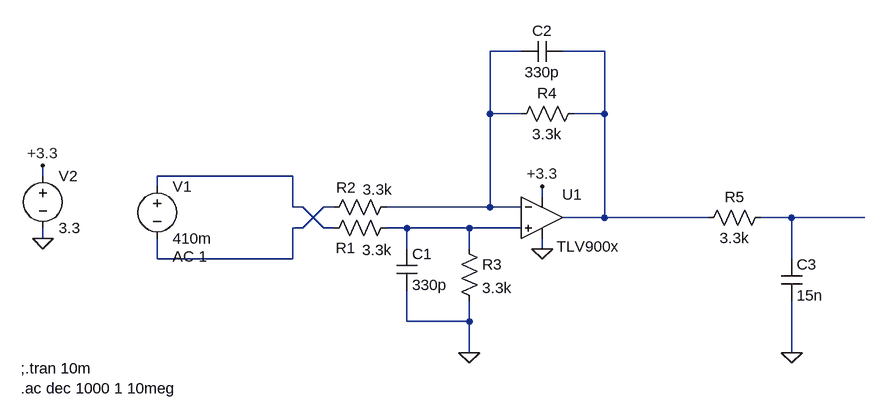
[diagram p0: schematic diff_to_singleended.asc]
diff_to_singleended.asc, the LTspice schematic file:
Version 4
SHEET 1 880 680
WIRE 176 -80 128 -80
WIRE 304 -80 240 -80
WIRE 128 16 128 -80
WIRE 176 16 128 16
WIRE 304 16 304 -80
WIRE 304 16 256 16
WIRE -560 112 -560 96
WIRE -176 112 -384 112
WIRE -384 128 -384 112
WIRE 208 144 208 128
WIRE -176 160 -176 112
WIRE -160 160 -176 160
WIRE -112 160 -128 160
WIRE 128 160 128 16
WIRE 128 160 -32 160
WIRE 176 160 128 160
WIRE 304 176 304 16
WIRE 304 176 240 176
WIRE 464 176 304 176
WIRE 592 176 544 176
WIRE 704 176 592 176
WIRE -160 192 -128 160
WIRE -160 192 -176 192
WIRE -128 192 -160 160
WIRE -112 192 -128 192
WIRE 0 192 -32 192
WIRE 96 192 0 192
WIRE 176 192 96 192
WIRE -560 208 -560 192
WIRE 0 224 0 192
WIRE 96 224 96 192
WIRE 208 224 208 208
WIRE -384 240 -384 208
WIRE -176 240 -176 192
WIRE -176 240 -384 240
WIRE 592 240 592 176
WIRE 0 336 0 288
WIRE 96 336 96 304
WIRE 96 336 0 336
WIRE 96 384 96 336
WIRE 592 384 592 304
FLAG 96 384 0
FLAG 208 224 0
FLAG 208 128 +3.3
FLAG -560 208 0
FLAG -560 96 +3.3
FLAG 592 384 0
SYMBOL AutoGenerated\\TLV900x 208 176 R0
WINDOW 0 46 -20 Bottom 2
WINDOW 3 71 29 Top 2
SYMATTR InstName U1
SYMBOL res -16 176 R90
WINDOW 0 62 78 VBottom 2
WINDOW 3 34 30 VTop 2
SYMATTR InstName R1
SYMATTR Value 3.3k
SYMBOL res -16 144 R90
WINDOW 0 1 77 VBottom 2
WINDOW 3 -27 29 VTop 2
SYMATTR InstName R2
SYMATTR Value 3.3k
SYMBOL cap -16 224 R0
SYMATTR InstName C1
SYMATTR Value 330p
SYMBOL res 80 208 R0
SYMATTR InstName R3
SYMATTR Value 3.3k
SYMBOL res 272 0 R90
WINDOW 0 0 56 VBottom 2
WINDOW 3 32 56 VTop 2
SYMATTR InstName R4
SYMATTR Value 3.3k
SYMBOL cap 240 -96 R90
WINDOW 0 0 32 VBottom 2
WINDOW 3 32 32 VTop 2
SYMATTR InstName C2
SYMATTR Value 330p
SYMBOL voltage -384 112 R0
WINDOW 123 24 124 Left 2
WINDOW 39 0 0 Left 0
SYMATTR InstName V1
SYMATTR Value 410m
SYMATTR Value2 AC 1
SYMBOL voltage -560 96 R0
WINDOW 123 0 0 Left 0
WINDOW 39 0 0 Left 0
SYMATTR InstName V2
SYMATTR Value 3.3
SYMBOL res 560 160 R90
WINDOW 0 0 56 VBottom 2
WINDOW 3 32 56 VTop 2
SYMATTR InstName R5
SYMATTR Value 3.3k
SYMBOL cap 576 240 R0
SYMATTR InstName C3
SYMATTR Value 15n
TEXT -594 408 Left 2 !;.tran 10m\n.ac dec 1000 1 10meg

The netlist it stands for:
* diff_to_singleended.asc
* U1: TLV900x (symbol AutoGenerated\TLV900x not available, pins judged from their places): In+=N006 In-=N001 V+=+3.3 V-=0 OUT=N002
R1 N006 N003 3.3k
R2 N001 N004 3.3k
C1 N006 0 330p
R3 N006 0 3.3k
R4 N002 N001 3.3k
C2 N002 N001 330p
V1 N003 N004 410m AC 1
V2 +3.3 0 3.3
R5 N005 N002 3.3k
C3 N005 0 15n
;.tran 10m
.ac dec 1000 1 10meg
.backanno
.end